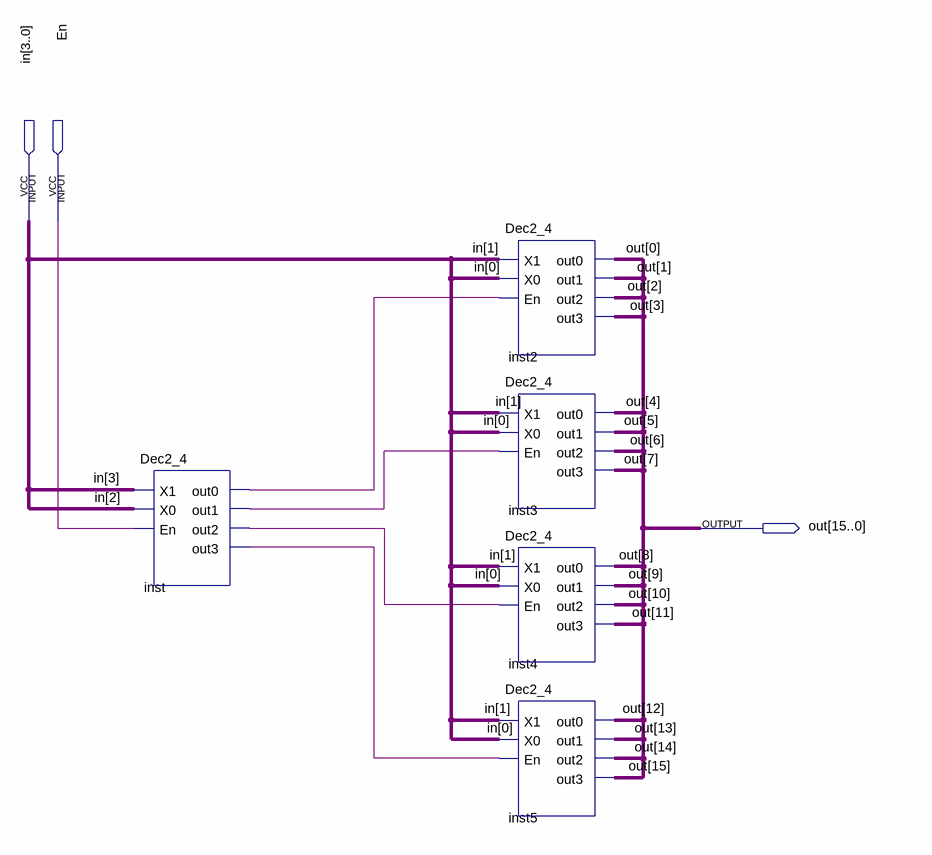
[diagram p0: schematic sheet]
// Quartus schematic Dec4_16.bdf as structural Verilog: 5 symbols, 3 pins
module Dec4_16 (
  input  [3:0] in,
  input  En,
  output [15:0] out
);

  wire inst_out0, inst_out1, inst_out2, inst_out3;

  Dec2_4 inst (.X1(in[3]), .X0(in[2]), .En(En), .out0(inst_out0), .out1(inst_out1), .out2(inst_out2), .out3(inst_out3));
  Dec2_4 inst2 (.X1(in[1]), .X0(in[0]), .En(inst_out0), .out0(out[0]), .out1(out[1]), .out2(out[2]), .out3(out[3]));
  Dec2_4 inst3 (.X1(in[1]), .X0(in[0]), .En(inst_out1), .out0(out[4]), .out1(out[5]), .out2(out[6]), .out3(out[7]));
  Dec2_4 inst4 (.X1(in[1]), .X0(in[0]), .En(inst_out2), .out0(out[8]), .out1(out[9]), .out2(out[10]), .out3(out[11]));
  Dec2_4 inst5 (.X1(in[1]), .X0(in[0]), .En(inst_out3), .out0(out[12]), .out1(out[13]), .out2(out[14]), .out3(out[15]));
endmodule
